# EAGLE schematic ltc2400_adc_module (EAGLE 7.4.0)
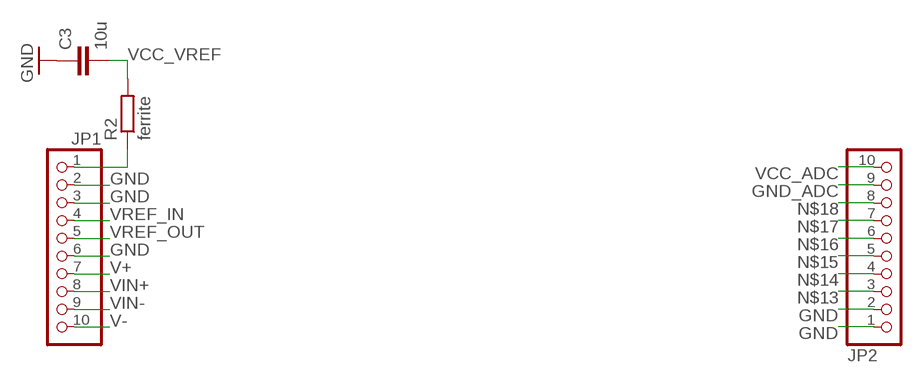
[diagram p0: schematic, sheet 1]

## Parts
C3  10u  C-EUC0805  [C0805]
JP1  PINHD-1X10NORM_OCT  [1X10_NORMAL_OCT]
JP2  PINHD-1X10NORM_OCT  [1X10_NORMAL_OCT]
R2  ferrite  R-EU_R0805  [R0805]

## Nets
GND: C3.1 JP1.2 JP1.3 JP1.6 JP2.1 JP2.2
GND_ADC: JP2.9
N$1: JP1.1 R2.1
N$13: JP2.3
N$14: JP2.4
N$15: JP2.5
N$16: JP2.6
N$17: JP2.7
N$18: JP2.8
V+: JP1.7
V-: JP1.10
VCC_ADC: JP2.10
VCC_VREF: C3.2 R2.2
VIN+: JP1.8
VIN-: JP1.9
VREF_IN: JP1.4
VREF_OUT: JP1.5

## Library data of the parts
C3 = SquantorRCL:C-EU: CAPACITOR, European symbol
JP1 JP2 = SquantorConnectors:PINHD-1X10: PIN HEADER
R2 = SquantorRCL:R-EU_: RESISTOR, European symbol